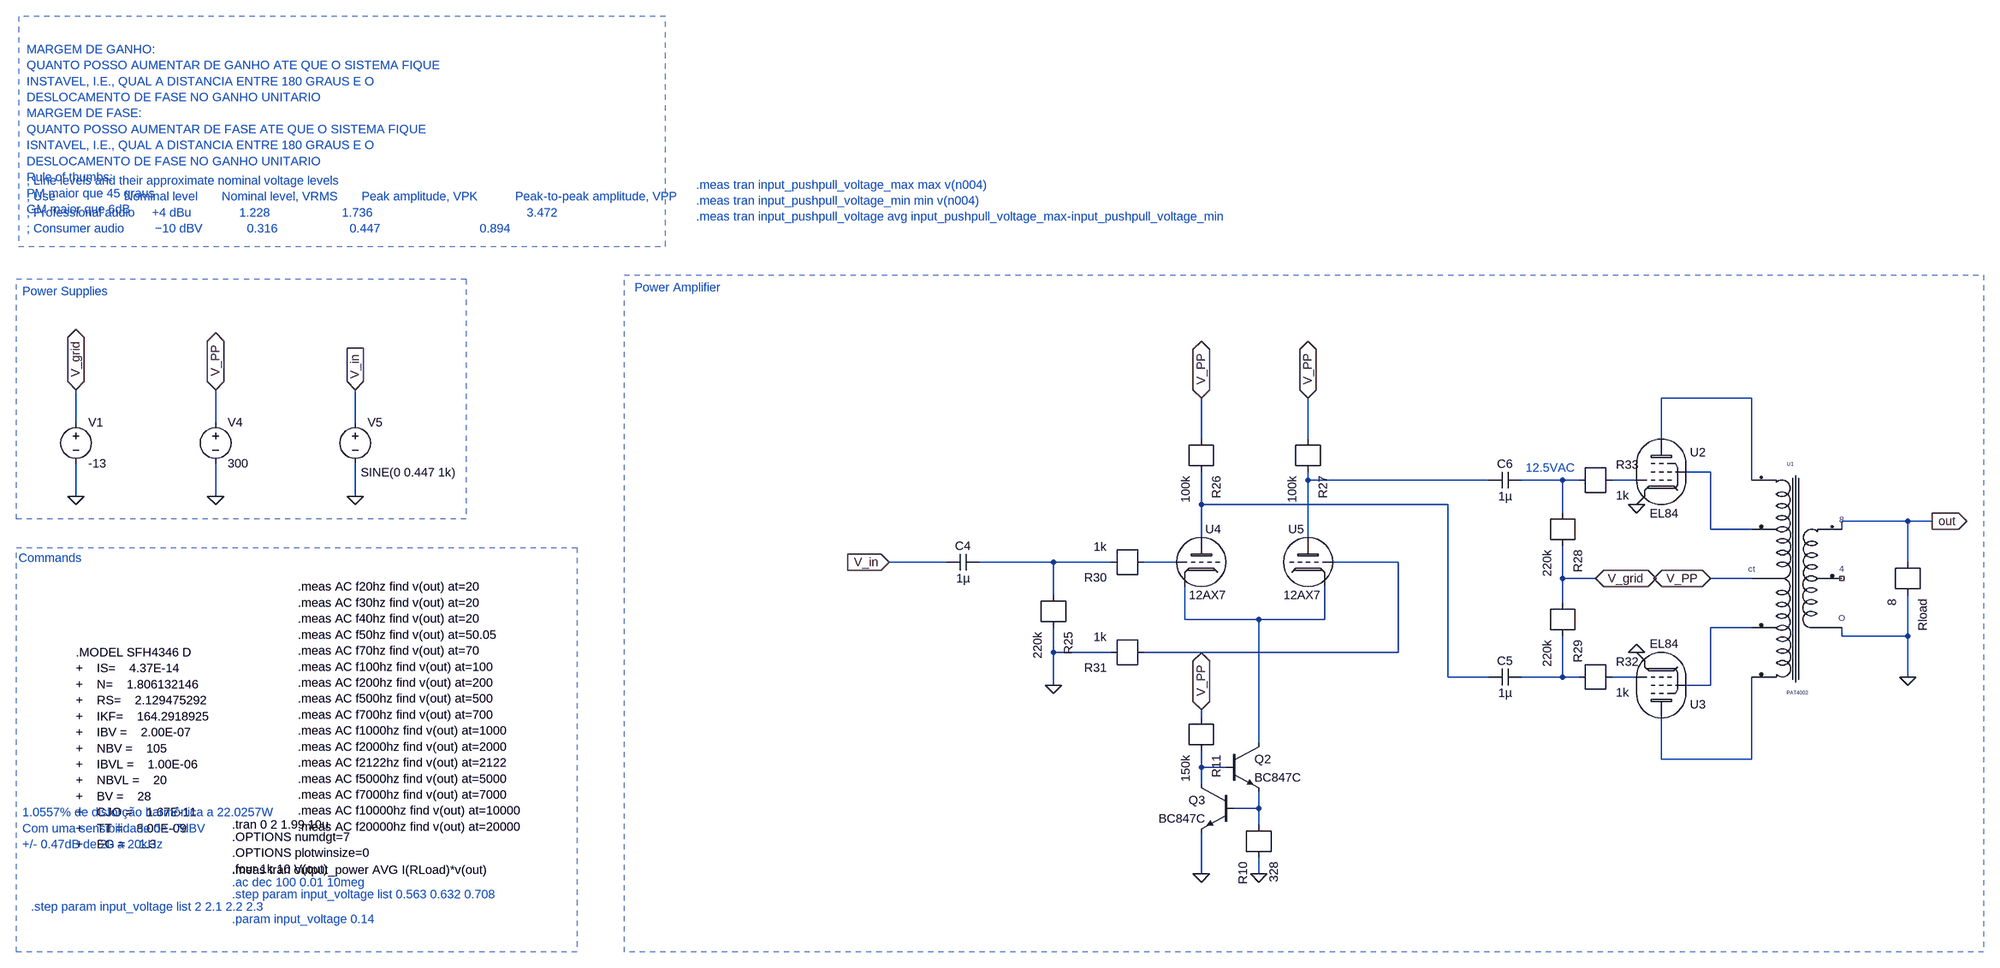
[diagram p0: schematic POWER_AMP_IC_rework_el84.asc]
POWER_AMP_IC_rework_el84.asc, the LTspice schematic file:
Version 4
SHEET 1 2188 1260
WIRE 896 -1200 720 -1200
WIRE -2368 -1152 -2368 -1216
WIRE -2096 -1152 -2096 -1216
WIRE -1824 -1152 -1824 -1216
WIRE -176 -1120 -176 -1200
WIRE 32 -1120 32 -1200
WIRE 720 -1120 720 -1200
WIRE 816 -1056 768 -1056
WIRE 32 -1040 32 -1056
WIRE 384 -1040 32 -1040
WIRE 528 -1040 448 -1040
WIRE 560 -1040 528 -1040
WIRE 672 -1040 624 -1040
WIRE 896 -1040 896 -1200
WIRE -2368 -1008 -2368 -1072
WIRE -2096 -1008 -2096 -1072
WIRE -1824 -1008 -1824 -1072
WIRE -176 -992 -176 -1056
WIRE 304 -992 -176 -992
WIRE 528 -976 528 -1040
WIRE 1200 -960 1072 -960
WIRE 1248 -960 1200 -960
WIRE 816 -944 816 -1056
WIRE 896 -944 816 -944
WIRE 1072 -944 1072 -960
WIRE -176 -928 -176 -992
WIRE 32 -928 32 -1040
WIRE -672 -880 -784 -880
WIRE -464 -880 -608 -880
WIRE -352 -880 -464 -880
WIRE -224 -880 -288 -880
WIRE 208 -880 80 -880
WIRE 1200 -880 1200 -960
WIRE 528 -848 528 -912
WIRE 592 -848 528 -848
WIRE 896 -848 816 -848
WIRE -464 -816 -464 -880
WIRE 528 -800 528 -848
WIRE -208 -768 -208 -832
WIRE -64 -768 -208 -768
WIRE 64 -768 64 -832
WIRE 64 -768 -64 -768
WIRE 896 -752 816 -752
WIRE 1072 -736 1072 -752
WIRE 1200 -736 1200 -816
WIRE 1200 -736 1072 -736
WIRE -464 -704 -464 -752
WIRE -352 -704 -464 -704
WIRE 208 -704 208 -880
WIRE 208 -704 -288 -704
WIRE 304 -656 304 -992
WIRE 384 -656 304 -656
WIRE 528 -656 528 -736
WIRE 528 -656 448 -656
WIRE 560 -656 528 -656
WIRE 672 -656 624 -656
WIRE 1200 -656 1200 -736
WIRE -464 -640 -464 -704
WIRE 816 -640 816 -752
WIRE 816 -640 768 -640
WIRE -176 -576 -176 -592
WIRE -64 -528 -64 -768
WIRE 720 -496 720 -576
WIRE 896 -496 896 -656
WIRE 896 -496 720 -496
WIRE -176 -480 -176 -512
WIRE -128 -480 -176 -480
WIRE -176 -448 -176 -480
WIRE -64 -400 -64 -432
WIRE -64 -400 -112 -400
WIRE -64 -368 -64 -400
WIRE -176 -272 -176 -352
WIRE -64 -272 -64 -304
FLAG -1824 -1008 0
FLAG -2096 -1008 0
FLAG -2368 -1008 0
FLAG -2368 -1216 V_grid
IOPIN -2368 -1216 BiDir
FLAG 32 -1200 V_PP
IOPIN 32 -1200 BiDir
FLAG -1824 -1216 V_in
IOPIN -1824 -1216 In
FLAG -464 -640 0
FLAG 672 -992 0
FLAG 672 -704 0
FLAG -784 -880 V_in
IOPIN -784 -880 In
FLAG 592 -848 V_grid
IOPIN 592 -848 BiDir
FLAG 1200 -656 0
FLAG -64 -272 0
FLAG -176 -272 0
FLAG 1248 -960 out
IOPIN 1248 -960 Out
FLAG -176 -1200 V_PP
IOPIN -176 -1200 BiDir
FLAG -2096 -1216 V_PP
IOPIN -2096 -1216 BiDir
FLAG 816 -848 V_PP
IOPIN 816 -848 BiDir
FLAG -176 -592 V_PP
IOPIN -176 -592 BiDir
SYMBOL voltage -2096 -1168 R0
SYMATTR InstName V4
SYMATTR Value 300
SYMBOL voltage -1824 -1168 R0
WINDOW 3 11 113 Left 2
SYMATTR Value SINE(0 0.447 1k)
SYMATTR InstName V5
SYMATTR Value2 AC 1
SYMBOL voltage -2368 -1168 R0
SYMATTR InstName V1
SYMATTR Value -13
SYMBOL npn -128 -528 R0
SYMATTR InstName Q2
SYMATTR Value BC847C
SYMBOL npn -112 -448 M0
SYMATTR InstName Q3
SYMATTR Value BC847C
SYMBOL r -64 -368 M90
SYMATTR InstName R10
SYMATTR Value 328
SYMBOL r -176 -576 R90
SYMATTR InstName R11
SYMATTR Value 150k
SYMBOL r -464 -816 R90
SYMATTR InstName R25
SYMATTR Value 220k
SYMBOL r -176 -1120 R90
SYMATTR InstName R26
SYMATTR Value 100k
SYMBOL r 32 -1120 R90
SYMATTR InstName R27
SYMATTR Value 100k
SYMBOL cap -608 -896 R90
WINDOW 0 0 32 VBottom 2
WINDOW 3 32 32 VTop 2
SYMATTR InstName C4
SYMATTR Value 1µ
SYMBOL r 528 -976 R90
SYMATTR InstName R28
SYMATTR Value 220k
SYMBOL r 528 -800 R90
SYMATTR InstName R29
SYMATTR Value 220k
SYMBOL r -288 -880 R180
SYMATTR InstName R30
SYMATTR Value 1k
SYMBOL r -288 -704 R180
SYMATTR InstName R31
SYMATTR Value 1k
SYMBOL r 560 -656 R0
SYMATTR InstName R32
SYMATTR Value 1k
SYMBOL r 560 -1040 R0
SYMATTR InstName R33
SYMATTR Value 1k
SYMBOL cap 448 -672 R90
WINDOW 0 0 32 VBottom 2
WINDOW 3 32 32 VTop 2
SYMATTR InstName C5
SYMATTR Value 1µ
SYMBOL cap 448 -1056 R90
WINDOW 0 0 32 VBottom 2
WINDOW 3 32 32 VTop 2
SYMATTR InstName C6
SYMATTR Value 1µ
SYMBOL r 1200 -880 R90
SYMATTR InstName Rload
SYMATTR Value 8
SYMBOL Trafos/PAT4002 976 -848 R0
SYMATTR InstName U1
SYMBOL Tubes/EL84 720 -1056 R0
SYMATTR InstName U2
SYMBOL Tubes/EL84 720 -640 M180
SYMATTR InstName U3
SYMBOL NormanKoren/12AX7 -176 -880 R0
SYMATTR InstName U4
SYMBOL NormanKoren/12AX7 32 -880 M0
SYMATTR InstName U5
TEXT -2064 -368 Left 2 !.tran 0 2 1.99 10u
TEXT -2064 -344 Left 2 !.OPTIONS numdgt=7\n.OPTIONS plotwinsize=0\n.four 1k 10 V(out)
TEXT -2368 -704 Left 2 !.MODEL SFH4346 D	\n+	IS=	4.37E-14\n+	N=	1.806132146\n+	RS=	2.129475292\n+	IKF=	164.2918925\n+	IBV =	2.00E-07\n+	NBV =	105\n+	IBVL =	1.00E-06\n+	NBVL =	20\n+	BV =	28\n+	CJO =	1.67E-11\n+	TT =	8.00E-09\n+	EG =	1.3
TEXT -2064 -256 Left 2 ;.ac dec 100 0.01 10meg
TEXT -1936 -832 Left 2 !.meas AC f20hz find v(out) at=20\n.meas AC f30hz find v(out) at=20\n.meas AC f40hz find v(out) at=20\n.meas AC f50hz find v(out) at=50.05\n.meas AC f70hz find v(out) at=70\n.meas AC f100hz find v(out) at=100\n.meas AC f200hz find v(out) at=200\n.meas AC f500hz find v(out) at=500\n.meas AC f700hz find v(out) at=700\n.meas AC f1000hz find v(out) at=1000\n.meas AC f2000hz find v(out) at=2000\n.meas AC f2122hz find v(out) at=2122\n.meas AC f5000hz find v(out) at=5000\n.meas AC f7000hz find v(out) at=7000\n.meas AC f10000hz find v(out) at=10000\n.meas AC f20000hz find v(out) at=20000
TEXT -2480 -888 Left 2 ;Commands
TEXT -2472 -1408 Left 2 ;Power Supplies
TEXT -2464 -1880 Left 2 ;MARGEM DE GANHO:\nQUANTO POSSO AUMENTAR DE GANHO ATE QUE O SISTEMA FIQUE\nINSTAVEL, I.E., QUAL A DISTANCIA ENTRE 180 GRAUS E O \nDESLOCAMENTO DE FASE NO GANHO UNITARIO\nMARGEM DE FASE:\nQUANTO POSSO AUMENTAR DE FASE ATE QUE O SISTEMA FIQUE \nISNTAVEL, I.E., QUAL A DISTANCIA ENTRE 180 GRAUS E O \nDESLOCAMENTO DE FASE NO GANHO UNITARIO\nRule of thumbs:\nPM maior que 45 graus\nGM maior que 6dB
TEXT -1280 -1416 Left 2 ;Power Amplifier
TEXT -2064 -280 Left 2 !.meas tran output_power AVG I(RLoad)*v(out)
TEXT -2064 -232 Left 2 ;.step param input_voltage list 0.563 0.632 0.708
TEXT -2472 -392 Left 2 ;1.0557% de distorção harmônica a 22.0257W\nCom uma sensibilidade de -7dBV\n+/- 0.47dB de 20 a 20kHz
TEXT -2456 -208 Left 2 ;.step param input_voltage list 2 2.1 2.2 2.3
TEXT -2064 -184 Left 2 ;.param input_voltage 0.14
TEXT -2464 -1624 Left 2 ;; Line levels and their approximate nominal voltage levels\n; Use                	Nominal level   	Nominal level, VRMS   	Peak amplitude, VPK   		Peak-to-peak amplitude, VPP\n; Professional audio 	+4 dBu          	1.228                 	1.736                 							3.472\n; Consumer audio     	−10 dBV         	0.316                 	0.447                 			0.894
TEXT -1160 -1616 Left 2 ;.meas tran input_pushpull_voltage_max max v(n004)\n.meas tran input_pushpull_voltage_min min v(n004)\n.meas tran input_pushpull_voltage avg input_pushpull_voltage_max-input_pushpull_voltage_min
TEXT 456 -1064 Left 2 ;12.5VAC
RECTANGLE Normal -2484 -908 -1392 -120 2
RECTANGLE Normal -2484 -1432 -1608 -964 2
RECTANGLE Normal -1300 -1440 1348 -120 2
RECTANGLE Normal -2480 -1496 -1220 -1944 2

The netlist it stands for:
* POWER_AMP_IC_rework_el84.asc
V4 V_PP 0 300
V5 V_in 0 SINE(0 0.447 1k) AC 1
V1 V_grid 0 -13
Q2 N010 N015 N016 0 BC847C
Q3 N015 N016 0 0 BC847C
R10 0 N016 328
R11 N015 V_PP 150k
R25 0 N007 220k
R26 N006 V_PP 100k
R27 N003 V_PP 100k
C4 N007 V_in 1µ
R28 V_grid N004 220k
R29 N012 V_grid 220k
R30 N007 N008 1k
R31 0 N009 1k
R32 N013 N012 1k
R33 N005 N004 1k
C5 N012 N006 1µ
C6 N004 N003 1µ
Rload 0 out 8
XU1 N001 N002 V_PP N011 N014 out NC_01 0 PAT4002  ; pins p1 st1 ct st2 p2 8 4 O
XU2 N001 N002 N005 0 EL84  ; pins Placa Grade_Screen Grade_controle Câtodo
XU3 N014 N011 N013 0 EL84  ; pins Placa Grade_Screen Grade_controle Câtodo
XU4 N006 N008 N010 12AX7  ; pins Plate Grid Cathode
XU5 N003 N009 N010 12AX7  ; pins Plate Grid Cathode
.model NPN NPN
.model PNP PNP
.lib standard.bjt
.tran 0 2 1.99 10u
.OPTIONS numdgt=7
.OPTIONS plotwinsize=0
.four 1k 10 V(out)
.MODEL SFH4346 D
+	IS=	4.37E-14
+	N=	1.806132146
+	RS=	2.129475292
+	IKF=	164.2918925
+	IBV =	2.00E-07
+	NBV =	105
+	IBVL =	1.00E-06
+	NBVL =	20
+	BV =	28
+	CJO =	1.67E-11
+	TT =	8.00E-09
+	EG =	1.3
* .ac dec 100 0.01 10meg
.meas AC f20hz find v(out) at=20
.meas AC f30hz find v(out) at=20
.meas AC f40hz find v(out) at=20
.meas AC f50hz find v(out) at=50.05
.meas AC f70hz find v(out) at=70
.meas AC f100hz find v(out) at=100
.meas AC f200hz find v(out) at=200
.meas AC f500hz find v(out) at=500
.meas AC f700hz find v(out) at=700
.meas AC f1000hz find v(out) at=1000
.meas AC f2000hz find v(out) at=2000
.meas AC f2122hz find v(out) at=2122
.meas AC f5000hz find v(out) at=5000
.meas AC f7000hz find v(out) at=7000
.meas AC f10000hz find v(out) at=10000
.meas AC f20000hz find v(out) at=20000
* Commands
* Power Supplies
* MARGEM DE GANHO:
* QUANTO POSSO AUMENTAR DE GANHO ATE QUE O SISTEMA FIQUE
* INSTAVEL, I.E., QUAL A DISTANCIA ENTRE 180 GRAUS E O
* DESLOCAMENTO DE FASE NO GANHO UNITARIO
* MARGEM DE FASE:
* QUANTO POSSO AUMENTAR DE FASE ATE QUE O SISTEMA FIQUE
* ISNTAVEL, I.E., QUAL A DISTANCIA ENTRE 180 GRAUS E O
* DESLOCAMENTO DE FASE NO GANHO UNITARIO
* Rule of thumbs:
* PM maior que 45 graus
* GM maior que 6dB
* Power Amplifier
.meas tran output_power AVG I(RLoad)*v(out)
* .step param input_voltage list 0.563 0.632 0.708
* 1.0557% de distorção harmônica a 22.0257W
* Com uma sensibilidade de -7dBV
* +/- 0.47dB de 20 a 20kHz
* .step param input_voltage list 2 2.1 2.2 2.3
* .param input_voltage 0.14
* ; Line levels and their approximate nominal voltage levels
* ; Use                	Nominal level   	Nominal level, VRMS   	Peak amplitude, VPK   		Peak-to-peak amplitude, VPP
* ; Professional audio 	+4 dBu          	1.228                 	1.736                 							3.472
* ; Consumer audio     	−10 dBV         	0.316                 	0.447                 			0.894
* .meas tran input_pushpull_voltage_max max v(n004)
* .meas tran input_pushpull_voltage_min min v(n004)
* .meas tran input_pushpull_voltage avg input_pushpull_voltage_max-input_pushpull_voltage_min
* 12.5VAC
.lib trafos.lib
.lib tubes.lib
.lib tube.lib
.backanno
.end